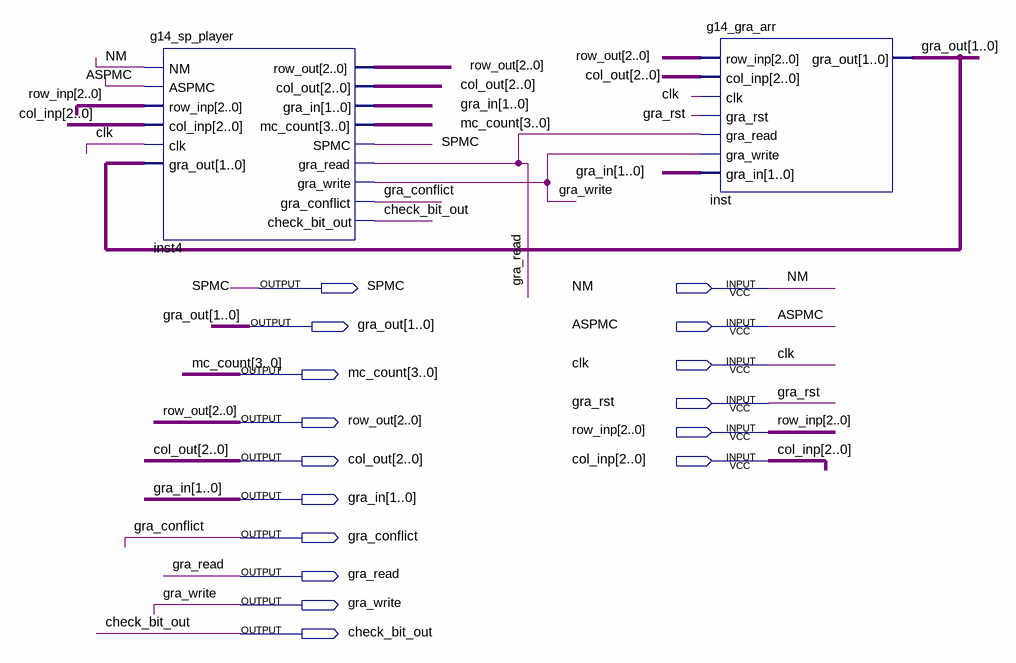
[diagram p0: schematic sheet]
// Quartus schematic g14_sp_player_combined.bdf as structural Verilog: 2 symbols, 16 pins
module g14_sp_player_combined (
  input  NM,
  input  ASPMC,
  input  clk,
  input  gra_rst,
  input  [2:0] row_inp,
  input  [2:0] col_inp,
  output SPMC,
  output [1:0] gra_out,
  output [3:0] mc_count,
  output [2:0] row_out,
  output [2:0] col_out,
  output [1:0] gra_in,
  output gra_conflict,
  output gra_read,
  output gra_write,
  output check_bit_out
);

  g14_sp_player inst4 (
    .NM(NM), .ASPMC(ASPMC), .row_inp(row_inp), .col_inp(col_inp), .clk(clk), .gra_out(gra_out),
    .row_out(row_out), .col_out(col_out), .gra_in(gra_in), .mc_count(mc_count), .SPMC(SPMC),
    .gra_read(gra_read), .gra_write(gra_write), .gra_conflict(gra_conflict), .check_bit_out(check_bit_out));
  g14_gra_arr inst (
    .row_inp(row_out), .col_inp(col_out), .clk(clk), .gra_rst(gra_rst), .gra_read(gra_read),
    .gra_write(gra_write), .gra_in(gra_in), .gra_out(gra_out));
endmodule
